# Altium project Tag103 Rev20.PrjPcb
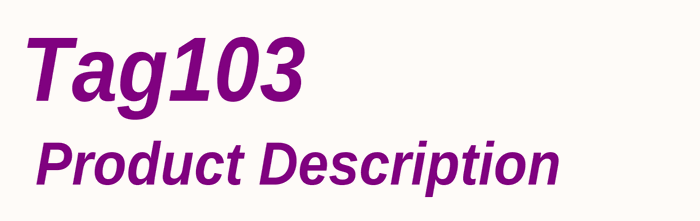
[diagram p0: PG01 Opening Page.SchDoc]
4 sheets, 68 parts. Net scope: global (net labels, ports and power ports of the same name join across sheets).
Sheets:
  PG01 Opening Page.SchDoc
  PG02 Index and Revs.SchDoc
  PG3 SHEET1.schdoc
  PG4 SHEET2.schdoc

## Sheet PG01 Opening Page.SchDoc: Opening Page
size B; Date: 2/10/2009; ApprovedBy: Touraj; DrawnBy: Juan A. Nadal; Engineer: Touraj; Organization: ActiveWave; Address1: 902 Clint Moore Rd., Suite 118; Address2: Boca Raton; Address3: FL, 33487; Address4: 561-999-9422; DocumentNumber: 1; Revision: 20; SheetNumber: 1; SheetTotal: 4; PageSetup: Record=PageOptions|CenterHorizontal=True|CenterVertical=True|PrintScale=0.68|XCorrection=1.00|YCorrection=1.00|PrintKind=0|BorderSize=5000000|LeftOffset=0|BottomOffset=0|Orientation=2|PaperLength=1000|PaperWidth=1000|Scale=100|PaperSource=7|PrintQuality=-4|MediaType=1|DitherType=10|PaperKind=Letter (8.5 x 11 in.)|PrintScaleMode=1; Project: Tag103

### Notes on the sheet
- Tag103
- Product Description
- APPROVALS
- DATE
- Title:
- Drawn:
- Checked:
- Release:
- Date:
- Size:
- Sheet Name:
- B
- Number:
- Time:
- Revision:
- Sheet
- of
- File:

## Sheet PG02 Index and Revs.SchDoc: Index and Revisions
size B; Date: 2/10/2009; ApprovedBy: Touraj; DrawnBy: Juan A. Nadal; Engineer: Touraj; Organization: ActiveWave; Address1: 902 Clint Moore Rd., Suite 118; Address2: Boca Raton; Address3: FL, 33487; Address4: 561-999-9422; DocumentNumber: 2; Revision: 20; SheetNumber: 2; SheetTotal: 4; PageSetup: Record=PageOptions|CenterHorizontal=True|CenterVertical=True|PrintScale=0.68|XCorrection=1.00|YCorrection=1.00|PrintKind=0|BorderSize=5000000|LeftOffset=0|BottomOffset=0|Orientation=2|PaperLength=1000|PaperWidth=1000|Scale=100|PaperSource=7|PrintQuality=-4|MediaType=1|DitherType=10|PaperKind=Letter|PrintScaleMode=1; Project: Tag103
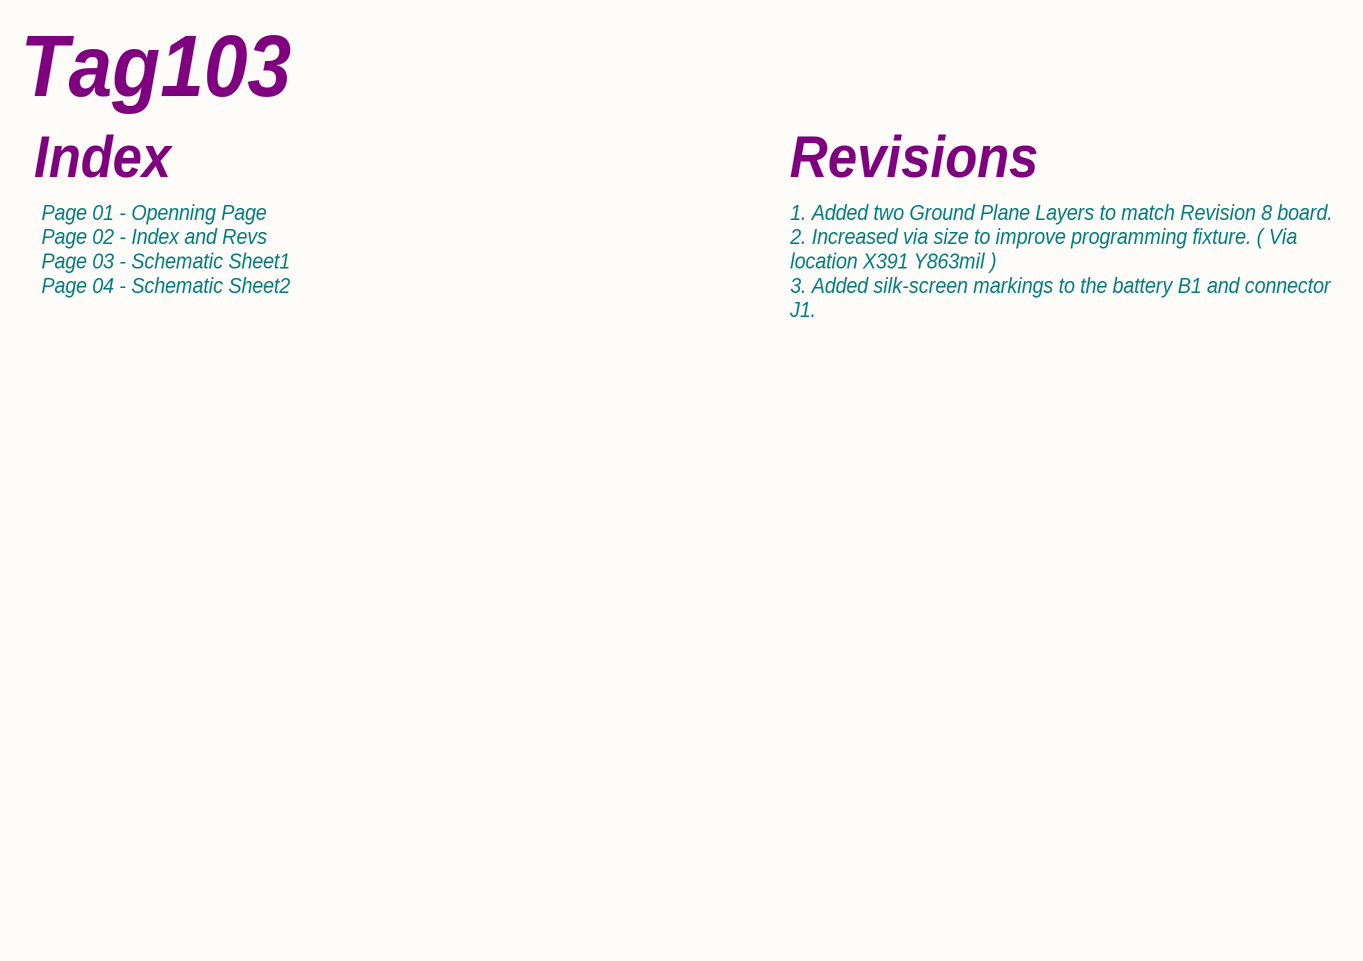
[diagram p1: PG02 Index and Revs.SchDoc]

### Notes on the sheet
- Tag103
- Index
- Revisions
- Page 01 - Openning Page
  Page 02 - Index and Revs
  Page 03 - Schematic Sheet1
  Page 04 - Schematic Sheet2
- 1. Added two Ground Plane Layers to match Revision 8 board.
  2. Increased via size to improve programming fixture. ( Via location X391 Y863mil )
  3. Added silk-screen markings to the battery B1 and connector J1.
- APPROVALS
- DATE
- Title:
- Drawn:
- Checked:
- Release:
- Date:
- Size:
- Sheet Name:
- B
- Number:
- Time:
- Revision:
- Sheet
- of
- File:

## Sheet PG3 SHEET1.schdoc
size B; Date: 2/10/2009; ApprovedBy: Touraj; DrawnBy: Juan A. Nadal; Engineer: Touraj; Organization: ActiveWave; Address1: 902 Clint Moore Rd., Suite 118; Address2: Boca Raton; Address3: FL, 33487; Address4: 561-999-9422; DocumentNumber: 3; Revision: 20; SheetNumber: 3; SheetTotal: 4; PageSetup: Record=PageOptions|CenterHorizontal=True|CenterVertical=True|PrintScale=0.70|XCorrection=1.00|YCorrection=1.00|PrintKind=0|BorderSize=5000000|LeftOffset=0|BottomOffset=0|Orientation=2|PaperLength=1000|PaperWidth=1000|Scale=100|PaperSource=7|PrintQuality=-4|MediaType=1|DitherType=10|PaperKind=Letter|PrintScaleMode=1; Project: Tag103
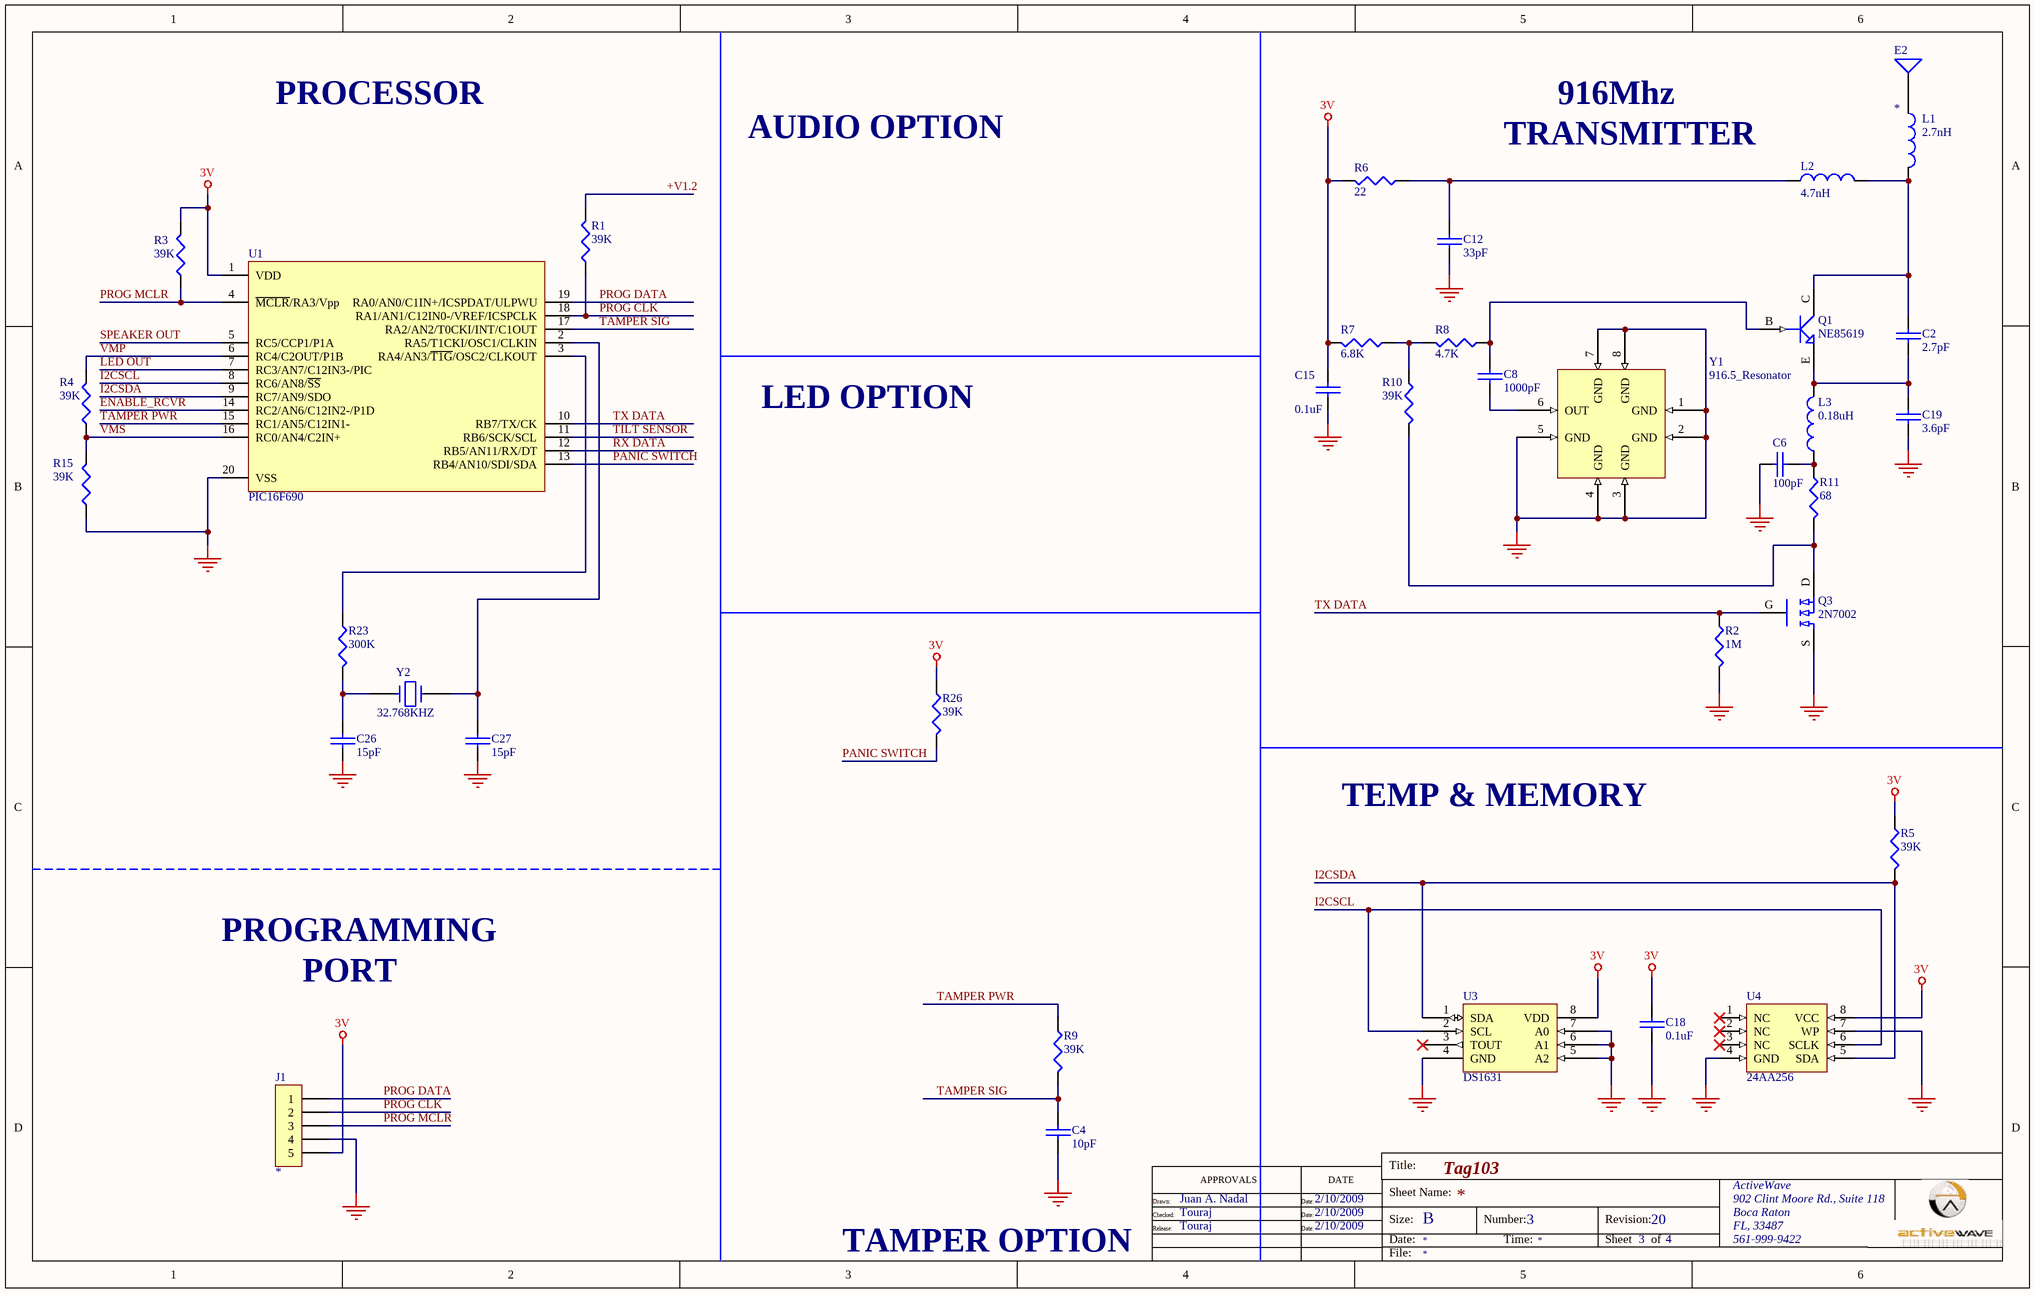
[diagram p2: PG3 SHEET1.schdoc]

### Parts
C2  value 2.7pF  [0603]  (hidden comment: 2 PF)
C4  10pF  [0603]
C6  value 100pF  [0603]  (hidden comment: 100 pF)
C8  value 1000pF  [0603]  (hidden comment: 1000 pF)
C12  value 33pF  [0603]  (hidden comment: 33 pF)
C15  value 0.1uF  [0603]  (hidden comment: 0.1 uF)
C18  value 0.1uF  [0603]  (hidden comment: 0.1 uF)
C19  value 3.6pF  [0603]  (hidden comment: 2.7 pF)
C26  15pF  [0603]
C27  15pF  [0603]
E2  *  [Antenna1]
J1  1X5 HEADER  [CONN5]  (value not drawn)
L1  2.7nH  [0603]
L2  value 4.7nH  [0603]  (hidden comment: 10nH)
L3  0.18uH  [0603]
Q1  NE85619  [3 PIN ULTRA SUPER MINI MOLD]
Q3  2N7002  [SOT23 FET]
R1  39K  [0603]
R2  value 1M  (hidden comment: 1 M)
R3  39K  [0603]
R4  39K  [0603]
R5  39K  [0603]
R6  22
R7  6.8K
R8  value 4.7K  (hidden comment: 4.7 K)
R9  39K  [0603]
R10  39K  [0603]
R11  68
R15  39K  [0603]
R23  300K  [0603]
R26  value 39K  [0603]  (hidden comment: 4.7M)
U1  PIC16F690  [SSOP20 WIDE]
U3  DS1631  [SO8 SMALL]
U4  24AA256  [SO8]
Y1  916.5_Resonator  [RESONATOR]
Y2  value 32.768KHZ  [CRYSTAL ABRACON ABS07]  (hidden comment: 32.768KHZ CRYSTAL)

### Nets
3V: C15.1 C18.1 J1.5 R3.2 R5.1 R6.2 R7.2 R26.1 U1.1(VDD) U3.8(VDD) U4.8(VCC)
GND: C4.2 C6.2 C12.2 C15.2 C18.2 C19.2 C26.2 C27.2 J1.4 Q3.S R2.2 R15.1 U1.20(VSS) U3.4(GND) U3.5(A2) U3.6(A1) U3.7(A0) U4.4(GND) U4.7(WP) Y1.1(GND) Y1.2(GND) Y1.3(GND) Y1.4(GND) Y1.5(GND) Y1.7(GND) Y1.8(GND)
+V1.2: R1.2
ENABLE_RCVR: U1.14(RC2/AN6/C12IN2-/P1D)
I2CSCL: U1.8(RC6/AN8/~{SS}) U3.2(SCL) U4.6(SCLK)
I2CSDA: R5.2 U1.9(RC7/AN9/SDO) U3.1(SDA) U4.5(SDA)
LED OUT: U1.7(RC3/AN7/C12IN3-/PIC)
PANIC SWITCH: R26.2 U1.13(RB4/AN10/SDI/SDA)
PROG CLK: J1.2 R1.1 U1.18(RA1/AN1/C12IN0-/VREF/ICSPCLK)
PROG DATA: J1.1 U1.19(RA0/AN0/C1IN+/ICSPDAT/ULPWU)
PROG MCLR: J1.3 R3.1 U1.4(~{MCLR}/RA3/Vpp)
RX DATA: U1.12(RB5/AN11/RX/DT)
SPEAKER OUT: U1.5(RC5/CCP1/P1A)
TAMPER PWR: R9.1 U1.15(RC1/AN5/C12IN1-)
TAMPER SIG: C4.1 R9.2 U1.17(RA2/AN2/T0CKI/INT/C1OUT)
TILT SENSOR: U1.11(RB6/SCK/SCL)
TX DATA: Q3.G R2.1 U1.10(RB7/TX/CK)
VMP: R4.2 U1.6(RC4/C2OUT/P1B)
VMS: R4.1 R15.2 U1.16(RC0/AN4/C2IN+)
NetC2_1: C2.1 L1.2 L2.2 Q1.C
NetC2_2: C2.2 C19.1 L3.2 Q1.E
NetC6_1: C6.1 L3.1 R11.1
NetC8_1: C8.1 Q1.B R8.1
NetC8_2: C8.2 Y1.6(OUT)
NetC12_1: C12.1 L2.1 R6.1
NetC26_1: C26.1 R23.2 Y2.1
NetC27_1: C27.1 U1.2(RA5/T1CKI/OSC1/CLKIN) Y2.2
NetE2_1: E2.1 L1.1
NetQ3_D: Q3.D R10.2 R11.2
NetR7_1: R7.1 R8.2 R10.1
NetR23_1: R23.1 U1.3(RA4/AN3/~{T1G}/OSC2/CLKOUT)

Not connected (* = marked no-connect by the designer): U3 3(TOUT)*; U4 1(NC)* 2(NC)* 3(NC)*

### Notes on the sheet
- PROCESSOR
- AUDIO OPTION
- TRANSMITTER
- 916Mhz
- LED OPTION
- TEMP & MEMORY
- PROGRAMMING
- PORT
- TAMPER OPTION
- APPROVALS
- DATE
- Title:
- Drawn:
- Checked:
- Release:
- Date:
- Size:
- Sheet Name:
- B
- Number:
- Time:
- Revision:
- Sheet
- of
- File:

### Library data of the parts
C2 C4 C6 C8 C12 C15 C18 C19 C26 C27 = CAP-0603: Capacitor; ACTIVEWAVE-P/N: *; ITEM-DESCRIPTION: *; MANUFACTURER: *; MFGR-P/N: *
  C4: VALUE: 10pF
  C26 C27: VALUE: 15pF
E2 = Antenna1: PART-VALUE: *
J1 = CON5: Connector; ACTIVEWAVE-P/N: *; ITEM-DESCRIPTION: *; MANUFACTURER: *; MFGR-P/N: *; PART-VALUE: *
L1-L3 = INDUCTOR: ACTIVEWAVE-P/N: *; ITEM-DESCRIPTION: *; MANUFACTURER: *; MFGR-P/N: *
  L1: VALUE: 2.7nH
  L3: VALUE: 0.18uH
Q1 = NE85619: NPN Transistor; ACTIVEWAVE-P/N: *; ITEM-DESCRIPTION: *; MANUFACTURER: *; MFGR-P/N: *; VALUE: NE85619
R1 R3-R5 R9 R10 R15 R23 R26 = RES-0603: ACTIVEWAVE-P/N: *; MFGR-P/N: *; MANUFACTURER: *; ITEM-DESCRIPTION: *
  R1 R3-R5 R9 R10 R15: VALUE: 39K
  R23: VALUE: 300K
R2 R6-R8 R11 = RES-0402: ACTIVEWAVE-P/N: *; MFGR-P/N: *; MANUFACTURER: *; ITEM-DESCRIPTION: *
  R6: VALUE: 22
  R7: VALUE: 6.8K
  R11: VALUE: 68
Y1 = RESONATOR: ACTIVEWAVE-P/N: *; ITEM-DESCRIPTION: *; MANUFACTURER: *; MFGR-P/N: *; VALUE: 916.5_Resonator
Y2 = CRYSTAL: ACTIVEWAVE-P/N: *; MANUFACTURER: *; ITEM-DESCRIPTION: *; MFGR-P/N: *
Q3 = 2N7002: ACTIVEWAVE-P/N: *; ITEM-DESCRIPTION: *; MANUFACTURER: *; MFGR-P/N: *; VALUE: 2N7002
U1 = PIC16F690: ACTIVEWAVE-P/N: *; ITEM-DESCRIPTION: *; MANUFACTURER: *; MFGR-P/N: *; VALUE: PIC16F690
U3 = DS1631: ACTIVEWAVE-P/N: *; ITEM-DECRIPTION: *; MANUFACTURER: *; MFGR-P/N: *; VALUE: DS1631
U4 = 24AA256: ACTIVEWAVE-P/N: *; MFGR-P/N: *; MANUFACTURER: *; ITEM-DESCRIPTION: *; VALUE: 24AA256

## Sheet PG4 SHEET2.schdoc
size B; Date: 2/10/2009; ApprovedBy: Touraj; DrawnBy: Juan A. Nadal; Engineer: Touraj; Organization: ActiveWave; Address1: 902 Clint Moore Rd., Suite 118; Address2: Boca Raton; Address3: FL, 33487; Address4: 561-999-9422; DocumentNumber: 4; Revision: 20; SheetNumber: 4; SheetTotal: 4; PageSetup: Record=PageOptions|CenterHorizontal=True|CenterVertical=True|PrintScale=0.70|XCorrection=1.00|YCorrection=1.00|PrintKind=0|BorderSize=5000000|LeftOffset=0|BottomOffset=0|Orientation=2|PaperLength=1000|PaperWidth=1000|Scale=100|PaperSource=7|PrintQuality=-4|MediaType=1|DitherType=10|PaperKind=Letter|PrintScaleMode=1; Project: Tag103
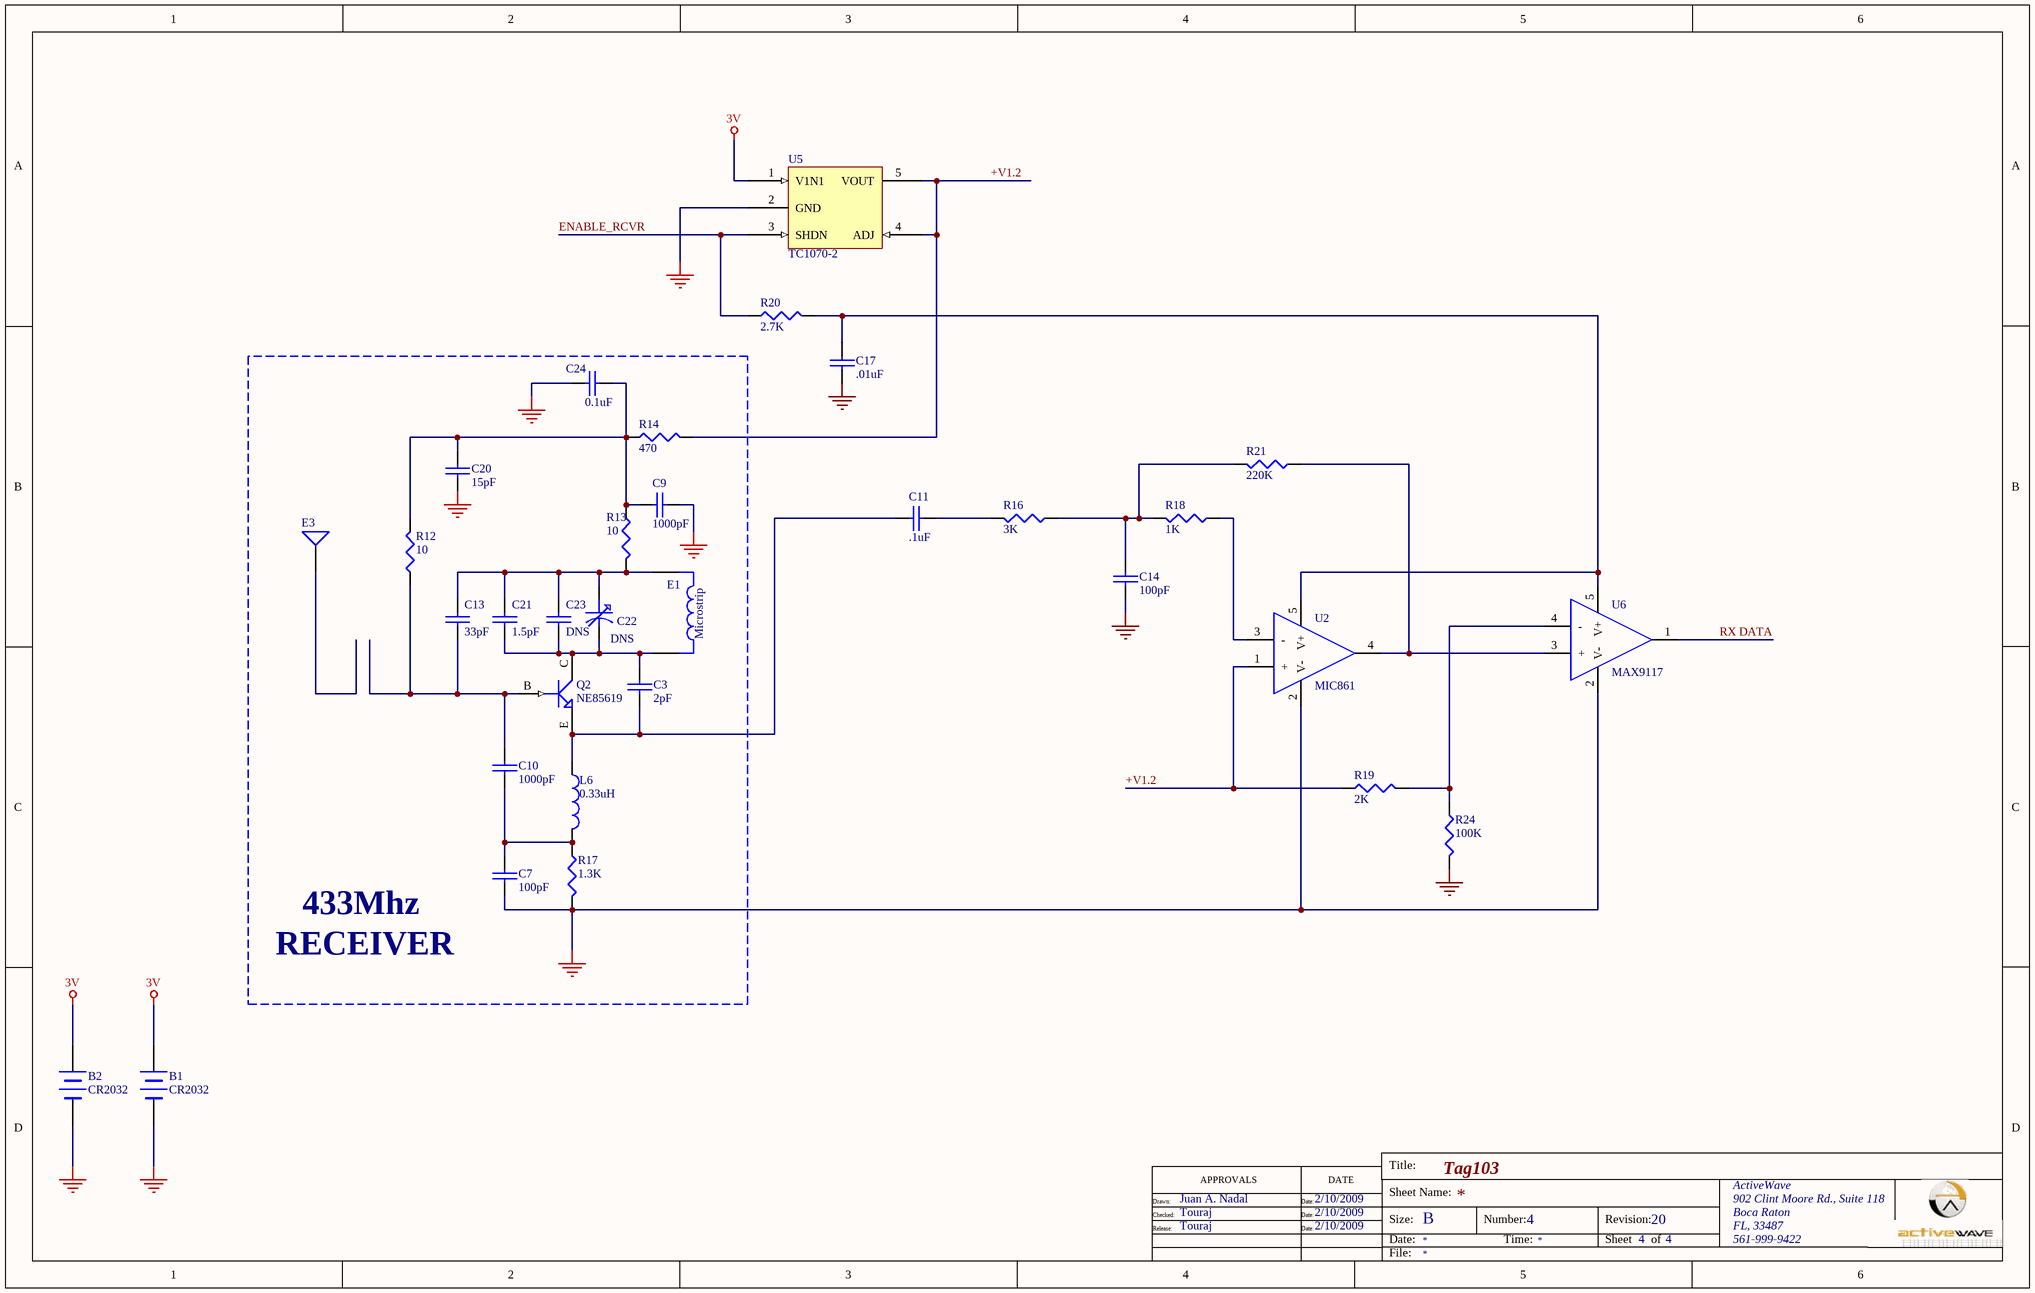
[diagram p3: PG4 SHEET2.schdoc]

### Parts
B1  value CR2032  [BATT HOLDER1]  (hidden comment: BATT HOLDER COIN CR2032 CUT)
B2  value CR2032  [BATT HOLDER COIN CR2032 CUT_VER1]  (hidden comment: BATT HOLDER COIN CR2032 CUT)
C3  value 2pF  [0603]  (hidden comment: 2 pF)
C7  value 100pF  [0603]  (hidden comment: 100 pF)
C9  value 1000pF  [0603]  (hidden comment: 1000 pF)
C10  value 1000pF  [0603]  (hidden comment: 1000 pF)
C11  .1uF  [0603]
C13  value 33pF  [0603]  (hidden comment: 33 pF)
C14  100pF  [0603]
C17  .01uF  [0603]
C20  15pF  [0603]
C21  1.5pF  [0603]
C22  DNS  [0603]
C23  DNS  [0603]
C24  value 0.1uF  [0603]  (hidden comment: 0.1 uF)
E1  Microstrip  [Antenna]  (net tie, no BOM)
E3  *  [Antenna1]  (value not drawn)
L6  0.33uH  [0603]
Q2  NE85619  [3 PIN ULTRA SUPER MINI MOLD]
R12  10  [0603]
R13  10  [0603]
R14  470  [0603]
R16  value 3K  [0603]  (hidden comment: 22K)
R17  value 1.3K  [0603]  (hidden comment: 2K)
R18  1K  [0603]
R19  2K  [0603]
R20  2.7K  [0603]
R21  220K  [0603]
R24  100K  [0603]
U2  MIC861  [SC70]
U5  value TC1070-2  [SOT23-5A]  (hidden comment: TC1070)
U6  value MAX9117  [SC70]  (hidden comment: MAX9119EXK+)

### Nets
3V: B1.2(+) B2.2(+) U5.1(V1N1)
GND: B1.1(-) B2.1(-) C7.2 C9.2 C14.1 C17.2 C20.2 C24.2 R17.2 R24.2 U2.2(V-) U5.2(GND) U6.2(V-)
+V1.2: R14.2 R19.1 U2.1(+) U5.4(ADJ) U5.5(VOUT)
ENABLE_RCVR: R20.1 U5.3(SHDN)
RX DATA: U6.1(OUT)
NetC3_1: C3.1 C21.2 C22.2 C23.2 E1.2 Q2.C
NetC3_2: C3.2 C11.1 L6.1 Q2.E
NetC7_1: C7.1 C10.2 L6.2 R17.1
NetC9_1: C9.1 C20.1 C24.1 R12.2 R13.1 R14.1
NetC10_1: C10.1 C13.2 Q2.B R12.1
NetC11_2: C11.2 R16.2
NetC13_1: C13.1 C21.1 C22.1 C23.1 E1.1 R13.2
NetC14_2: C14.2 R16.1 R18.2 R21.2
NetC17_1: C17.1 R20.2 U2.5(V+) U6.5(V+)
NetR18_1: R18.1 U2.3(-)
NetR19_2: R19.2 R24.1 U6.4(-)
NetR21_1: R21.1 U2.4(OUT) U6.3(+)

Not connected (* = marked no-connect by the designer): E3 1

### Notes on the sheet
- RECEIVER
- 433Mhz
- APPROVALS
- DATE
- Title:
- Drawn:
- Checked:
- Release:
- Date:
- Size:
- Sheet Name:
- B
- Number:
- Time:
- Revision:
- Sheet
- of
- File:

### Library data of the parts
B1 B2 = BATTERY2: Battery; ACTIVEWAVE-P/N: *; ITEM-DESCRIPTION: *; MANUFACTURER: *; MFGR-P/N: *
C3 C7 C9-C11 C13 C14 C17 C20 C21 C23 C24 = CAP-0603: Capacitor; ACTIVEWAVE-P/N: *; ITEM-DESCRIPTION: *; MANUFACTURER: *; MFGR-P/N: *
  C11: VALUE: .1uF
  C14: VALUE: 100pF
  C17: VALUE: .01uF
  C20: VALUE: 15pF
  C21: VALUE: 1.5pF
  C23: VALUE: DNS
C22 = CAPACITOR VAR: Text Field1: 20; Text Field2: 20
E1 = ANTENNA: PART-VALUE: *; ITEM-DESCRIPTION: Microstrip
E3 = Antenna1: PART-VALUE: *
L6 = INDUCTOR: ACTIVEWAVE-P/N: *; ITEM-DESCRIPTION: *; MANUFACTURER: *; MFGR-P/N: *; VALUE: 0.33uH
Q2 = NE85619: NPN Transistor; ACTIVEWAVE-P/N: *; ITEM-DESCRIPTION: *; MANUFACTURER: *; MFGR-P/N: *; VALUE: NE85619
R12-R14 R16-R21 R24 = RES-0603: ACTIVEWAVE-P/N: *; MFGR-P/N: *; MANUFACTURER: *; ITEM-DESCRIPTION: *
  R12 R13: VALUE: 10
  R14: VALUE: 470
  R18: VALUE: 1K
  R19: VALUE: 2K
  R20: VALUE: 2.7K
  R21: VALUE: 220K
  R24: VALUE: 100K
U2 = OPAMP MIC861: ACTIVEWAVE-P/N: *; ITEM-DESCRIPTION: *; MANUFACTURER: *; MFGR-P/N: *; VALUE: MIC861
U5 = TC1070-2: ACTIVEWAVE-P/N: *; ITEM-DESCRIPTION: *; MANUFACTURER: *; MFGR-P/N: *
U6 = COMPARATOR MAX9117: ACTIVEWAVE-P/N: *; ITEM-DESCRIPTION: *; MANUFACTURER: *; MFGR-P/N: *

## Nets that join several sheets
3V: PG3 SHEET1 (11 pins), PG4 SHEET2 (B1.2 B2.2 U5.1)
GND: PG3 SHEET1 (26 pins), PG4 SHEET2 (13 pins)
+V1.2: PG3 SHEET1 (R1.2), PG4 SHEET2 (5 pins)
ENABLE_RCVR: PG3 SHEET1 (U1.14), PG4 SHEET2 (R20.1 U5.3)
RX DATA: PG3 SHEET1 (U1.12), PG4 SHEET2 (U6.1)